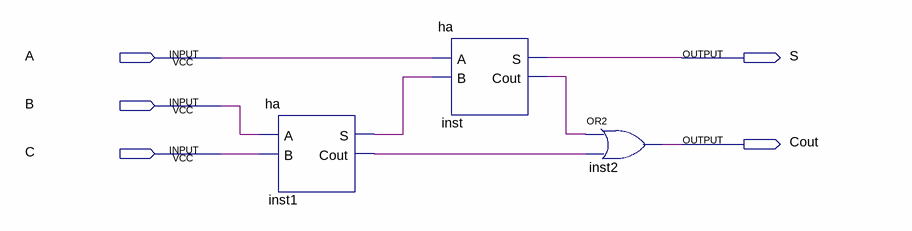
[diagram p0: schematic sheet]
// Quartus schematic fa.bdf as structural Verilog: 3 symbols, 5 pins
module fa (
  input  A,
  input  B,
  input  C,
  output S,
  output Cout
);

  wire inst1_cout, inst1_s, inst_cout;

  ha inst1 (.A(B), .B(C), .S(inst1_s), .Cout(inst1_cout));
  ha inst (.A(A), .B(inst1_s), .S(S), .Cout(inst_cout));
  or inst2 (Cout, inst_cout, inst1_cout);
endmodule
